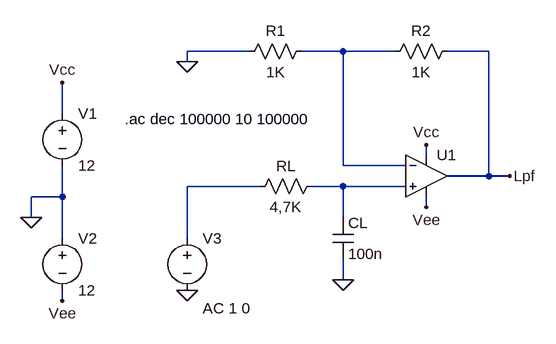
[diagram p0: schematic Apartado_B1.asc]
Apartado_B1.asc, the LTspice schematic file:
Version 4
SHEET 1 880 680
WIRE 320 0 224 0
WIRE 464 0 400 0
WIRE 544 0 464 0
WIRE 688 0 624 0
WIRE 224 16 224 0
WIRE 32 96 32 48
WIRE 592 160 592 144
WIRE 464 176 464 0
WIRE 560 176 464 176
WIRE 688 192 688 0
WIRE 688 192 624 192
WIRE 720 192 688 192
WIRE 336 208 224 208
WIRE 464 208 416 208
WIRE 560 208 464 208
WIRE 32 224 32 176
WIRE 32 224 -16 224
WIRE 592 240 592 224
WIRE -16 256 -16 224
WIRE 464 256 464 208
WIRE 32 288 32 224
WIRE 224 288 224 208
WIRE 464 352 464 320
WIRE 32 384 32 368
FLAG 224 368 0
FLAG 464 352 0
FLAG 224 16 0
FLAG -16 256 0
FLAG 32 48 Vcc
FLAG 592 144 Vcc
FLAG 720 192 Lpf
FLAG 32 384 Vee
FLAG 592 240 Vee
SYMBOL voltage 32 80 R0
WINDOW 123 0 0 Left 2
WINDOW 39 0 0 Left 2
SYMATTR InstName V1
SYMATTR Value 12
SYMBOL voltage 32 272 R0
WINDOW 123 0 0 Left 2
WINDOW 39 0 0 Left 2
SYMATTR InstName V2
SYMATTR Value 12
SYMBOL res 416 -16 R90
WINDOW 0 0 56 VBottom 2
WINDOW 3 32 56 VTop 2
SYMATTR InstName R1
SYMATTR Value 1K
SYMBOL res 432 192 R90
WINDOW 0 0 56 VBottom 2
WINDOW 3 32 56 VTop 2
SYMATTR InstName RL
SYMATTR Value 4,7K
SYMBOL res 640 -16 R90
WINDOW 0 0 56 VBottom 2
WINDOW 3 32 56 VTop 2
SYMATTR InstName R2
SYMATTR Value 1K
SYMBOL cap 448 256 R0
SYMATTR InstName CL
SYMATTR Value 100n
SYMBOL Opamps\\UniversalOpamp2 592 192 R0
SYMATTR InstName U1
SYMBOL voltage 224 272 R0
WINDOW 3 24 96 Invisible 2
WINDOW 123 24 124 Left 2
WINDOW 39 0 0 Left 2
SYMATTR InstName V3
SYMATTR Value SINE()
SYMATTR Value2 AC 1 0
TEXT 128 104 Left 2 !.ac dec 100000 10 100000

The netlist it stands for:
* Apartado_B1.asc
V1 Vcc 0 12
V2 0 Vee 12
R1 N001 0 1K
RL N003 N002 4,7K
R2 Lpf N001 1K
CL N003 0 100n
XU1 N003 N001 Vcc Vee Lpf level.2 Avol=1Meg GBW=10Meg Slew=10Meg ilimit=25m rail=0 Vos=0 phimargin=45 en=0 enk=0 in=0 ink=0 Rin=500Meg  ; pins IN+ IN- V+ V- OUT
V3 N002 0 SINE() AC 1 0
.ac dec 100000 10 100000
.lib UniversalOpamps2.sub
.backanno
.end

* Results of the author's LTspice run, read from the files saved beside the schematic
* Operating Point, zero values left out:
*   V(vcc) = 12 V
*   V(vee) = -12 V
*   I(V2) = -1.199 mA
*   I(V1) = -1.199 mA
*   Ix(u1:3) = 1.199 mA
*   Ix(u1:4) = -1.199 mA